# Altium schematic sheet [04] CONNECTORS.SchDoc
size A
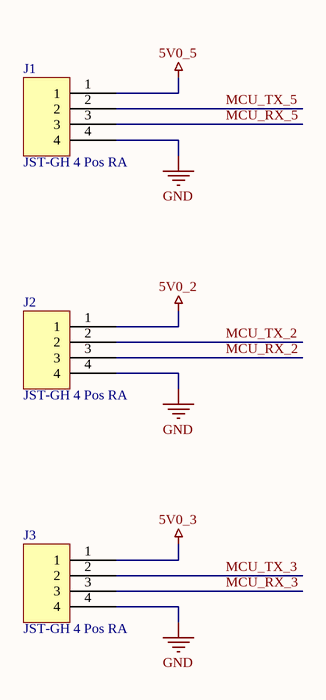
[diagram p0: [04] CONNECTORS.SchDoc]

## Parts
J1  JST-GH 4 Pos RA  [SM04B-GHS-TB(LF)(SN)-]
J2  JST-GH 4 Pos RA  [SM04B-GHS-TB(LF)(SN)-]
J3  JST-GH 4 Pos RA  [SM04B-GHS-TB(LF)(SN)-]

## Nets
5V0_2: J2.1
5V0_3: J3.1
5V0_5: J1.1
GND: J1.4 J2.4 J3.4
MCU_RX_2: J2.3
MCU_RX_3: J3.3
MCU_RX_5: J1.3
MCU_TX_2: J2.2
MCU_TX_3: J3.2
MCU_TX_5: J1.2

## Library data of the parts
J1-J3 = SM04B-GHS-TB(LF)(SN)-: JST-GH CONN HEADER SMD R/A 4 POS 1.25MM; Manufacturer: JST; Connector Type: Outer Shroud Contact; Number of Positions: 4; Pitch: 0.049inch; Supplier 1: Digi-Key; Manufacturer Part Number: SM04B-GHS-TB(LF)(SN)-; RoHS: Yes; Category: Connectors; Stock 1: 34258; Pricing 1: 1=0.45000, 10=0.42300, 100=0.32440, 500=0.28212, 1000=0.23274 (USD); Mount: Surface Mount; Color: Natural; Contact Plating: Tin; Number of Rows: 1; Fastening Type: Ramp; Packaging: Cut Tape; Termination: Solder; ComponentLink1URL: https://datasheet.ciiva.com/6832/egh-6832463.pdf?src-supplier=Digi-Key; ComponentLink1Description: https://datasheet.ciiva.com/6832/egh-6832463.pdf?src-supplier=Digi-Key; Supplier Part Number 1: 455-1566-1-ND